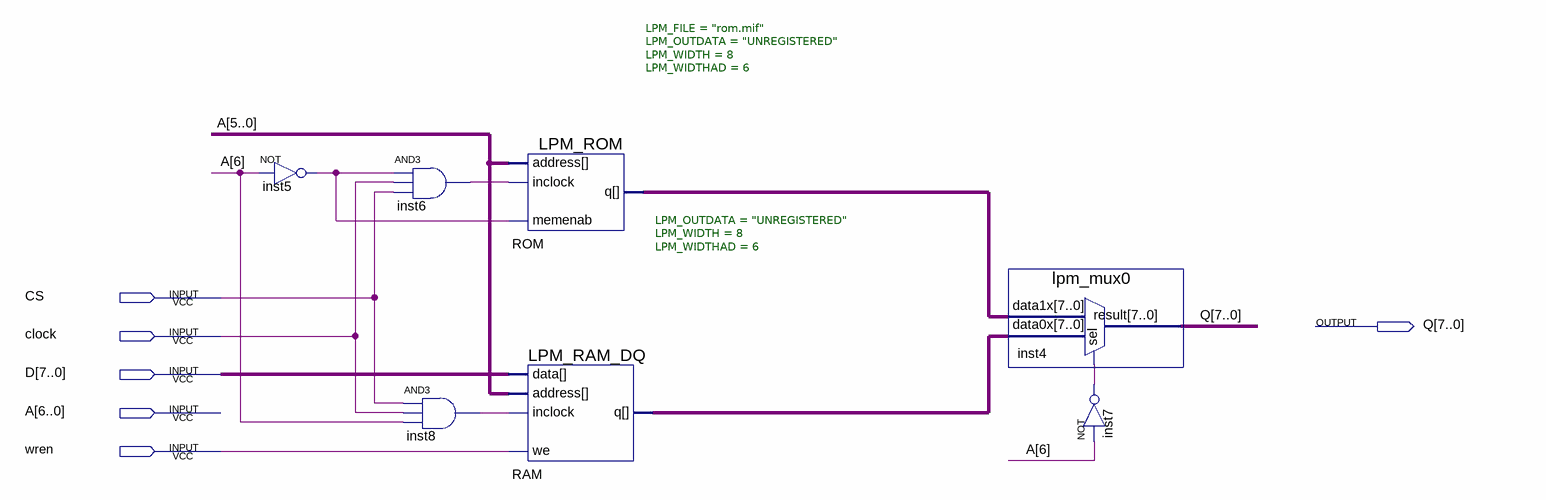
[diagram p0: schematic sheet]
// Quartus schematic EX_3.bdf as structural Verilog: 7 symbols, 6 pins
module EX_3 (
  input  CS,
  input  clock,
  input  [7:0] D,
  input  [6:0] A,
  input  wren,
  output [7:0] Q
);

  wire inst5_out, inst6_out, inst7_out, inst8_out;
  wire [7:0] RAM_q, ROM_q;

  not inst5 (inst5_out, A[6]);
  and inst6 (inst6_out, inst5_out, clock, CS);
  and inst8 (inst8_out, CS, clock, A[6]);
  LPM_ROM #(.LPM_FILE("rom.mif"), .LPM_OUTDATA("UNREGISTERED"), .LPM_WIDTH(8), .LPM_WIDTHAD(6)) ROM (
    .address(A[5:0]), .inclock(inst6_out), .memenab(inst5_out), .q(ROM_q));
  LPM_RAM_DQ #(.LPM_OUTDATA("UNREGISTERED"), .LPM_WIDTH(8), .LPM_WIDTHAD(6)) RAM (
    .address(A[5:0]), .data(D), .inclock(inst8_out), .we(wren), .q(RAM_q));
  lpm_mux0 inst4 (.data1x(ROM_q), .data0x(RAM_q), .sel(inst7_out), .result(Q));
  not inst7 (inst7_out, A[6]);
endmodule
